# Altium project ACZCProject.PrjPcb
Revision: 00A; Project: ACZCProject; Author: G. Marquez
2 sheets, 2 parts. Net scope: global (net labels, ports and power ports of the same name join across sheets).
Sheets:
  TitleBlock.SchDoc
  PowerDelivery.SchDoc

## Sheet TitleBlock.SchDoc: Title Block
size 381 x 243 mm; Date: 12/1/24; SheetNumber: 1; SheetTotal: 2

### Parts
(Parts that share a designator on the sheet are numbered #1, #2 ... from top to bottom, then left to right.)
?#1  (no value)

### Notes on the sheet
- Drawn By:
- Date Created:
- Last Updated:
- Checked By:
- Revision
- Sheet #
- of

### Library data of the parts
?#1 = Title Block

## Sheet PowerDelivery.SchDoc: Power Delivery
size 381 x 243 mm; Date: 12/1/24; SheetNumber: 2; SheetTotal: 2

### Parts
(Parts that share a designator on the sheet are numbered #1, #2 ... from top to bottom, then left to right.)
?#2  (no value)

### Notes on the sheet
- Drawn By:
- Date Created:
- Last Updated:
- Checked By:
- Revision
- Sheet #
- of

### Library data of the parts
?#2 = Title Block